# EAGLE schematic SparkFun_RedStick-ProtoPanel-v01 (EAGLE 7.4.0)
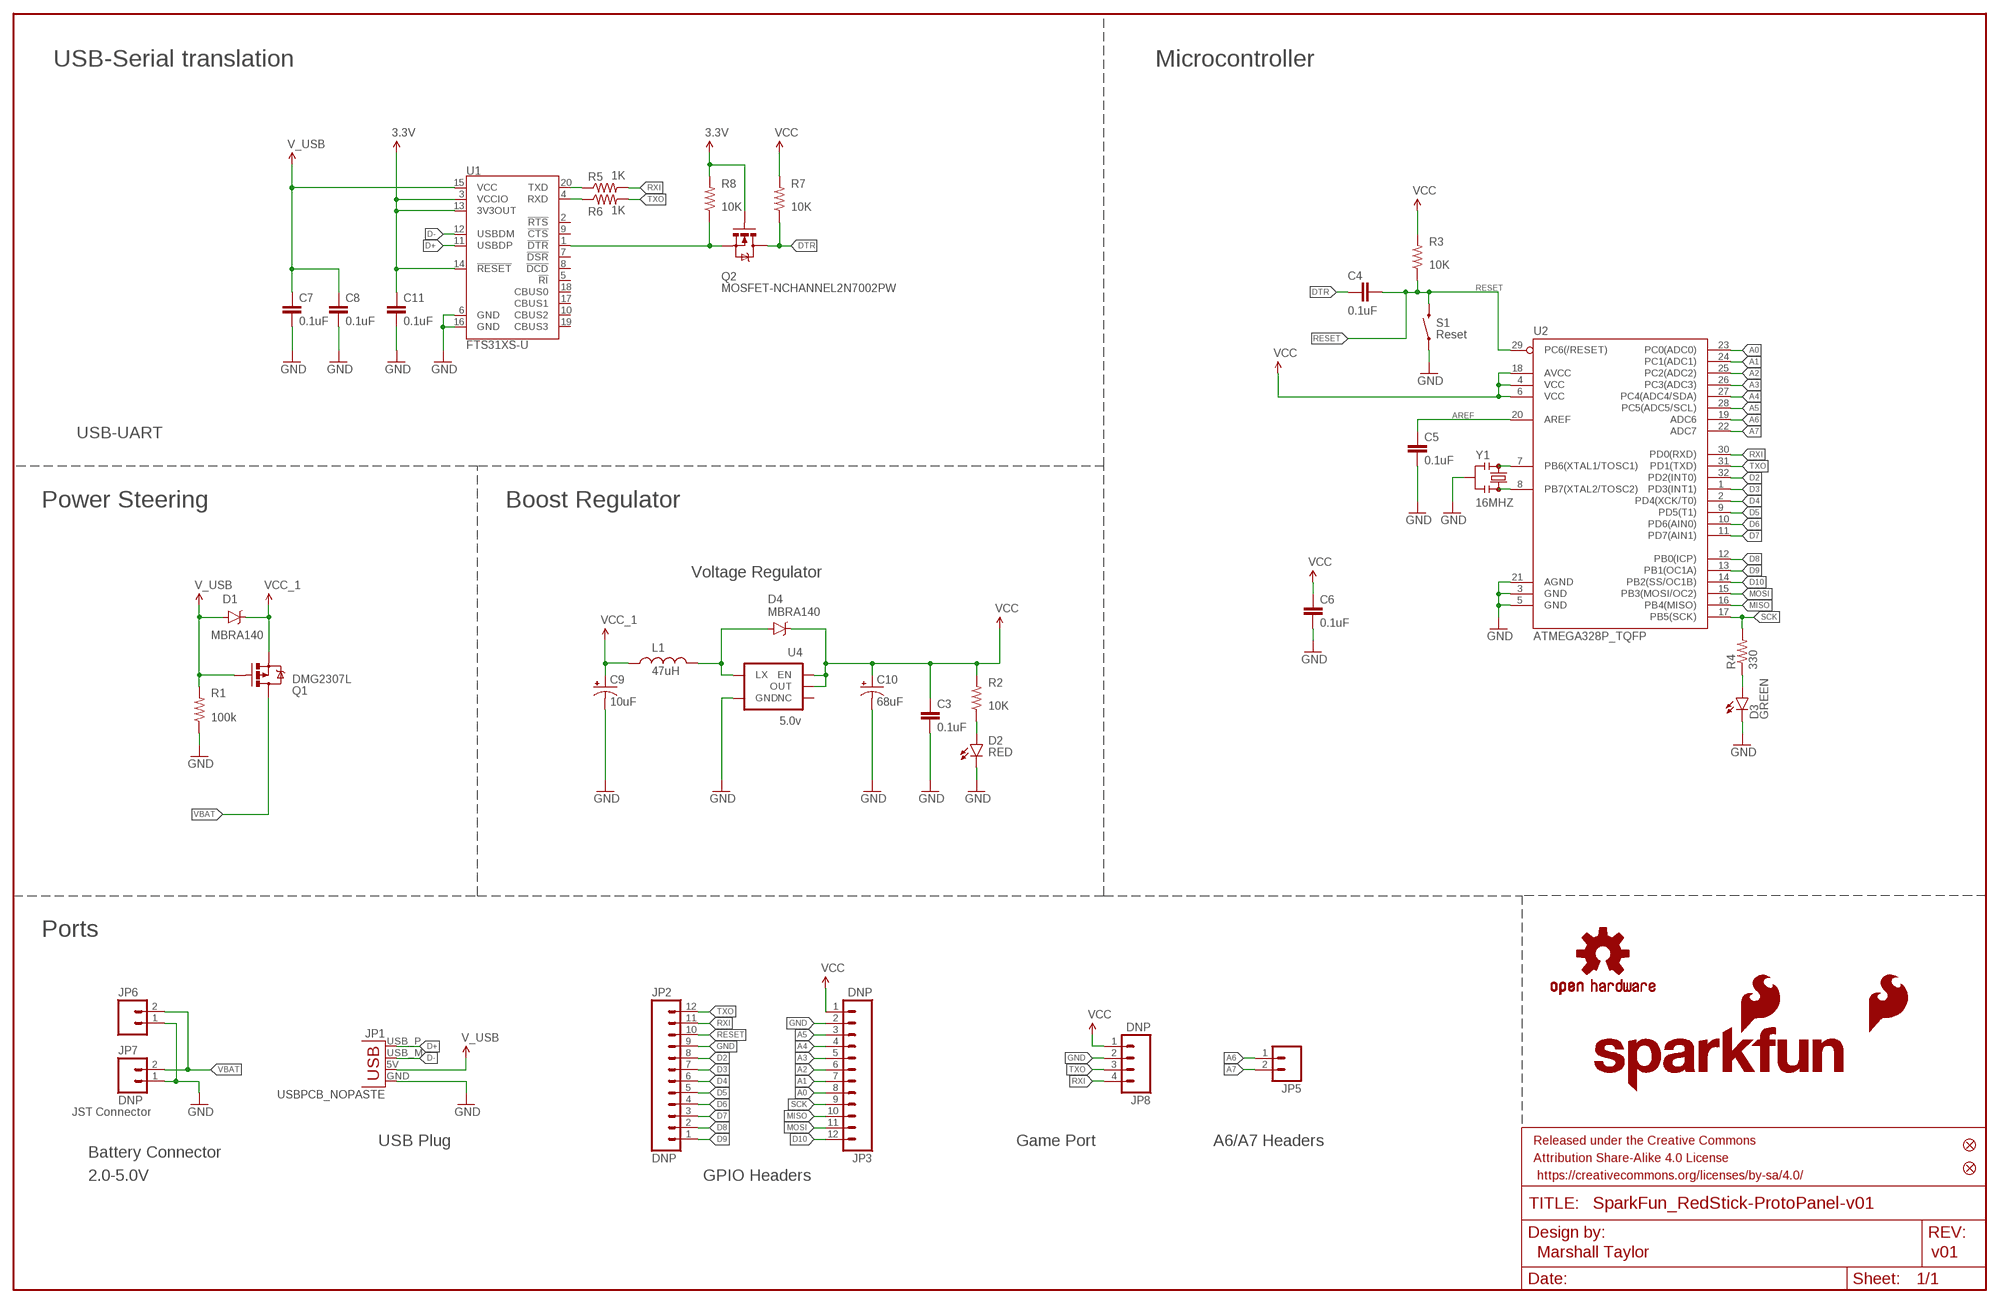
[diagram p0: schematic, sheet 1]

## Parts
C3  0.1uF  0.1UF-25V(+80/-20%)(0603)  [0603-CAP]
C4  0.1uF  0.1UF-25V(+80/-20%)(0603)  [0603-CAP]
C5  0.1uF  0.1UF-25V(+80/-20%)(0603)  [0603-CAP]
C6  0.1uF  0.1UF-25V(+80/-20%)(0603)  [0603-CAP]
C7  0.1uF  0.1UF-25V(+80/-20%)(0603)  [0603-CAP]
C8  0.1uF  0.1UF-25V(+80/-20%)(0603)  [0603-CAP]
C9  10uF  10UF-16V-10%(TANT)  [EIA3216]
C10  68uF  68UF-10V-10%(TANT)  [EIA3528]
C11  0.1uF  0.1UF-25V(+80/-20%)(0603)  [0603-CAP]
D1  MBRA140  DIODE-SCHOTTKY-MBRA140  [SMA-DIODE]
D2  RED  LED-RED0603  [LED-0603]
D3  GREEN  LED-GREEN0603  [LED-0603]
D4  MBRA140  DIODE-SCHOTTKY-MBRA140  [SMA-DIODE]
FID1  FIDUCIAL1X2  [FIDUCIAL-1X2]
FID2  FIDUCIAL1X2  [FIDUCIAL-1X2]
FRAME2  FRAME-LEDGER  [CREATIVE_COMMONS]
JP1  USBPCB_NOPASTE  [USB-A-PCB-NOPASTE]
JP2  DNP  M12LOCK_NO_SILK  [1X12_LOCK_NO_SILK]
JP3  DNP  M12LOCK_NO_SILK  [1X12_LOCK_NO_SILK]
JP5  M021X02_NO_SILK  [1X02_NO_SILK]
JP6  M021X02_NO_SILK  [1X02_NO_SILK]
JP7  DNP  M02JST-PTH-2  [JST-2-PTH]
JP8  DNP  M04PTH  [1X04]
L1  47uH  INDUCTORCR54-47UH  [CR54]
LOGO1  SFE_LOGO_FLAME.1_INCH  [SFE_LOGO_FLAME_.1]
LOGO2  OSHW-LOGOS  [OSHW-LOGO-S]
Q1  DMG2307L  MOSFET-PCHANNELDMG2307L  [SOT23-3]
Q2  MOSFET-NCHANNEL2N7002PW  [SOT323]
R1  100k  100KOHM-1/10W-1%(0603)  [0603-RES]
R2  10K  10KOHM-1/10W-1%(0603)0603  [0603-RES]
R3  10K  10KOHM-1/10W-1%(0603)0603  [0603-RES]
R4  330  330OHM1/10W1%(0603)  [0603-RES]
R5  1K  1KOHM-1/10W-1%(0603)  [0603-RES]
R6  1K  1KOHM-1/10W-1%(0603)  [0603-RES]
R7  10K  10KOHM-1/10W-1%(0603)0603  [0603-RES]
R8  10K  10KOHM-1/10W-1%(0603)0603  [0603-RES]
S1  SWITCH-MOMENTARY-2SMD-REDUNDANT  [TACTILE-SWITCH-SMD]
U1  FTS31XS-U  FT231XS  [SSOP20_L]
U2  ATMEGA328P_TQFP  [TQFP32-08]
U4  5.0v  V_REG_NCP1400_5V  [SOT23-5]
U$1  SFE_LOGO_NAME_FLAME.1_INCH  [SFE_LOGO_NAME_FLAME_.1]
Y1  16MHZ  RESONATOR16MHZ  [RESONATOR-SMD]

## Nets
3.3V: C11.1 Q2.1(G) R8.2 U1.3(VCCIO) U1.13(3V3OUT) U1.14(!RESET)
A0: JP3.8 U2.23(PC0(ADC0))
A1: JP3.7 U2.24(PC1(ADC1))
A2: JP3.6 U2.25(PC2(ADC2))
A3: JP3.5 U2.26(PC3(ADC3))
A4: JP3.4 U2.27(PC4(ADC4/SDA))
A5: JP3.3 U2.28(PC5(ADC5/SCL))
A6: JP5.1 U2.19(ADC6)
A7: JP5.2 U2.22(ADC7)
AREF: C5.1 U2.20(AREF)
D2: JP2.8 U2.32(PD2(INT0))
D3: JP2.7 U2.1(PD3(INT1))
D4: JP2.6 U2.2(PD4(XCK/T0))
D5: JP2.5 U2.9(PD5(T1))
D6: JP2.4 U2.10(PD6(AIN0))
D7: JP2.3 U2.11(PD7(AIN1))
D8: JP2.2 U2.12(PB0(ICP))
D9: JP2.1 U2.13(PB1(OC1A))
D10: JP3.12 U2.14(PB2(SS/OC1B))
D+: JP1.USB_P(D+) U1.11(USBDP)
D-: JP1.USB_M(D-) U1.12(USBDM)
DTR: C4.1 Q2.3(D) R7.1
GND: C3.2 C5.2 C6.2 C7.2 C8.2 C9.C(-) C10.C(-) C11.2 D2.C D3.C JP1.GND JP2.9 JP3.2 JP6.1 JP7.1 JP8.2 R1.1 S1.1 S1.2 U1.6(GND) U1.16(GND) U2.3(GND) U2.5(GND) U2.21(AGND) U4.4(GND) Y1.2
MISO: JP3.10 U2.16(PB4(MISO))
MOSI: JP3.11 U2.15(PB3(MOSI/OC2))
N$1: D3.A R4.1
N$3: R5.1 U1.20(TXD)
N$4: D2.A R2.1
N$5: U2.7(PB6(XTAL1/TOSC1)) Y1.1
N$6: U2.8(PB7(XTAL2/TOSC2)) Y1.3
N$7: R6.1 U1.4(RXD)
N$8: D4.A L1.P$2 U4.5(LX)
N$11: Q2.2(S) R8.1 U1.1(!DTR)
RESET: C4.2 JP2.10 R3.1 S1.3 S1.4 U2.29(PC6(/RESET))
RXI: JP2.11 JP8.4 R5.2 U2.30(PD0(RXD))
SCK: JP3.9 R4.2 U2.17(PB5(SCK))
TXO: JP2.12 JP8.3 R6.2 U2.31(PD1(TXD))
V_USB: C7.1 C8.1 D1.A JP1.5V(VBUS) Q1.1(G) R1.2 U1.15(VCC)
VBAT: JP6.2 JP7.2 Q1.3(D)
VCC: C3.1 C6.1 C10.A(+) D4.C JP3.1 JP8.1 R2.2 R3.2 R7.2 U2.4(VCC) U2.6(VCC) U2.18(AVCC) U4.1(EN) U4.2(OUT)
VCC_1: C9.A(+) D1.C L1.P$1 Q1.2(S)
Unconnected: U1.2(!RTS) U1.5(!RI) U1.7(!DSR) U1.8(!DCD) U1.9(!CTS) U1.10(CBUS2) U1.17(CBUS1) U1.18(CBUS0) U1.19(CBUS3) U4.3(NC)

## Notes on the sheet
- USB-Serial translation | Microcontroller
- USB-UART
- Power Steering | Boost Regulator
- Voltage Regulator
- Ports
- JST Connector
- USB Plug | Game Port | A6/A7 Headers
- Battery Connector
- 2.0-5.0V | GPIO Headers
- Marshall Taylor | v01

## Library data of the parts
C3-C8 C11 = SparkFun-Capacitors:0.1UF-25V(+80/-20%)(0603): CAP-00810 Ceramic Standard decoupling cap; PROD_ID: CAP-00810
C9 = SparkFun-Capacitors:10UF-16V-10%(TANT): CAP-00811 1206/EIA-3216 Tantalum capacitor; PROD_ID: CAP-00811
C10 = SparkFun-Capacitors:68UF-10V-10%(TANT): CAP-10790; PROD_ID: CAP-10790
D1 D4 = SparkFun-DiscreteSemi:DIODE-SCHOTTKY: Schottky diodes in SFE's production catalog BAT20J 1A 23V 0.62Vf RB751 120mA 40V 0.37Vf PMEG4005EJ 0.5A 40V 0.42Vf MBRA140 1A 40V 0.5Vf B340A 3A 40V SMA; PROD_ID: DIO-08053
D2 = SparkFun-LED:LED-RED: Assorted Red LEDs LilyPad 1206- DIO-09912 1206- DIO-00809 0603- DIO-00819 "SMART" means more efficient and expensive; PROD_ID: DIO-00819
D3 = SparkFun-LED:LED-GREEN: Various green LEDs Green LEDs used in SFE Production 0603- DIO-00821 LARGE- DIO-00862 LILYPAD- DIO-09910; PROD_ID: DIO-00821
FID1 FID2 = SparkFun-Aesthetics:FIDUCIAL: Fiducial Alignment Points Various fiducial points for machine vision alignment.
FRAME2 = SparkFun-Aesthetics:FRAME-LEDGER: Schematic Frame Standard 11x14 US Ledger frame
JP1 = SparkFun-Connectors:USB: USB Connectors USB-B-PTH is fully proven SKU : PRT-00139/CONN-08278 USB-miniB is fully proven SKU : PRT-00587 USB-A-PCB is untested. USB-A-H is throughly reviewed, but untested. Spark Fun Electronics SKU : PRT-00437 USB-B-SMT is throughly reviewed, but untested. Needs silkscreen touching up. USB-A-S has not been used/tested USB-MB-H has not been used/tested USB-MICROB has been used. CONN-09505
JP2 JP3 = SparkFun-Connectors:M12: Header 12 Standard 12-pin 0.1" header. Use with straight break away headers (SKU : PRT-00116), right angle break away headers (PRT-00553), swiss pins (PRT-00743), machine pins (PRT-00117), and female headers (PRT-00115).
JP5 JP6 = SparkFun-Connectors:M02: Standard 2-pin 0.1" header. Use with - straight break away headers ( PRT-00116) - right angle break away headers (PRT-00553) - swiss pins (PRT-00743) - machine pins (PRT-00117) - female headers (PRT-00115) Molex polarized connector foot print use with: PRT-08233 with associated crimp pins and housings. 2.54_SCREWTERM for use with PRT-10571. 3.5mm Screw Terminal footprints for PRT-08084 5mm Screw Terminal footprints for use with PRT-08432
JP7 = SparkFun-Connectors:M02: Standard 2-pin 0.1" header. Use with - straight break away headers ( PRT-00116) - right angle break away headers (PRT-00553) - swiss pins (PRT-00743) - machine pins (PRT-00117) - female headers (PRT-00115) Molex polarized connector foot print use with: PRT-08233 with associated crimp pins and housings. 2.54_SCREWTERM for use with PRT-10571. 3.5mm Screw Terminal footprints for PRT-08084 5mm Screw Terminal footprints for use with PRT-08432; PROD_ID: CONN-09863; SKU: PRT-09914
JP8 = SparkFun-Connectors:M04: Header 4 Standard 4-pin 0.1" header. Use with straight break away headers (SKU : PRT-00116), right angle break away headers (PRT-00553), swiss pins (PRT-00743), machine pins (PRT-00117), and female headers (PRT-00115). Molex polarized connector foot print use with SKU : PRT-08231 with associated crimp pins and housings. 1MM SMD Version SKU: PRT-10208
L1 = SparkFun-Passives:INDUCTOR: Inductors Basic Inductor/Choke - 0603 and 1206. Footprints are not proven and vary greatly between part numbers. INDUCTOR POWER 3.3UH 4.0A SMD 0.197" L x 0.197" W x 0.177" H (5.00mm x 5.00mm x 4.50mm); PROD_ID: NDUC-10789
LOGO1 = SparkFun-Aesthetics:SFE_LOGO_FLAME: SFE Logo, flame only This is the SparkFun flame logo. The logo on the schematic will always be the same size; the package variant is the height of the flame. Default layer for the logo on the board is tSilk.
LOGO2 = SparkFun-Aesthetics:OSHW-LOGO: Open Source Hardware Logo This logo indicates the piece of hardware it is found on incorporates a OSHW license and/or adheres to the definition of open source hardware found here: http://freedomdefined.org/OSHW
Q1 = SparkFun-DiscreteSemi:MOSFET-PCHANNEL: Generic PMOSFET IRLML2244 - TRANS-11153 (SOT-23 -20V -4.3A) (1.Gate 2.Source 3.Drain) FQP27P06 - COM-10349 <http://www.sparkfun.com/products/10349> (TO-220 -60V -27A) (1.Gate 2.Source 3.Drain); PROD_ID: TRANS-11308; VALUE: 2.5A/30V
Q2 = SparkFun-DiscreteSemi:MOSFET-NCHANNEL: Common NMOSFET Parts MFG P/N Store ID Prod ID FDD8780 TRANS-09984 SI7820DN TRANS-11055 FDS6630A IC-08089 2N7002PW TRANS-11151 FQP30N06L COM-10213 TRANS-10060 BSS123LT1G TRANS-08345 BSS138 TRANS-00830 BS170 2N7000; PROD_ID: TRANS-11151
R1 = SparkFun-Resistors:100KOHM-1/10W-1%(0603): RES-07828; PROD_ID: RES-07828
R2 R3 R7 R8 = SparkFun-Resistors:10KOHM-1/10W-1%(0603): RES-00824; PROD_ID: RES-00824
R4 = SparkFun-Resistors:330OHM1/10W1%(0603): RES-00818; PROD_ID: RES-00818
R5 R6 = SparkFun-Resistors:1KOHM-1/10W-1%(0603): RES-07856; PROD_ID: RES-07856
S1 = SparkFun-Electromechanical:SWITCH-MOMENTARY-2: Various NO switches- pushbuttons, reed, etc; FUNC: Reset; PROD_ID: SWCH-08247
U1 = SparkFun-DigitalIC:FT231X: FTDI FT231X Full Speed USB to Full-handshake UART This USB2.0 Full Speed IC offers a compact bridge to full handshake UART interfaces. The device is a UART, capable of operating up to 3MBaud, with low power consumption (8mA). The FT231X includes the complete FT-X series feature set and enables USB to be added into a system design quickly and easily over a UART interface.; PROD_ID: IC-11524
U2 = SparkFun-DigitalIC:ATMEGA328P_TQFP; PROD_ID: IC-09069
U4 = SparkFun-PowerIC:V_REG_NCP1400: Switching step-up voltage regulator NCP1400 switiching regulator takes single cell AA and outputs 100mA at 3.3V or 5V with minimal number of external components.; PROD_ID: IC-10787
U$1 = SparkFun-Aesthetics:SFE_LOGO_NAME_FLAME: SFE Logo, name and flame This is the SparkFun full logo. The logo on the schematic will always be the same size; the package variant is the height of the flame part of the logo. Default layer for the logo on the board is tSilk.
Y1 = SparkFun-FreqCtrl:RESONATOR: Resonator Small SMD resonator. Used, eg, on the Arduino Pro/ Pro Mini boards. 8MHz- XTAL-08895 16MHz- XTAL-08900; PROD_ID: XTAL-08900